# EAGLE design V0.2 (EAGLE 9.5.2)
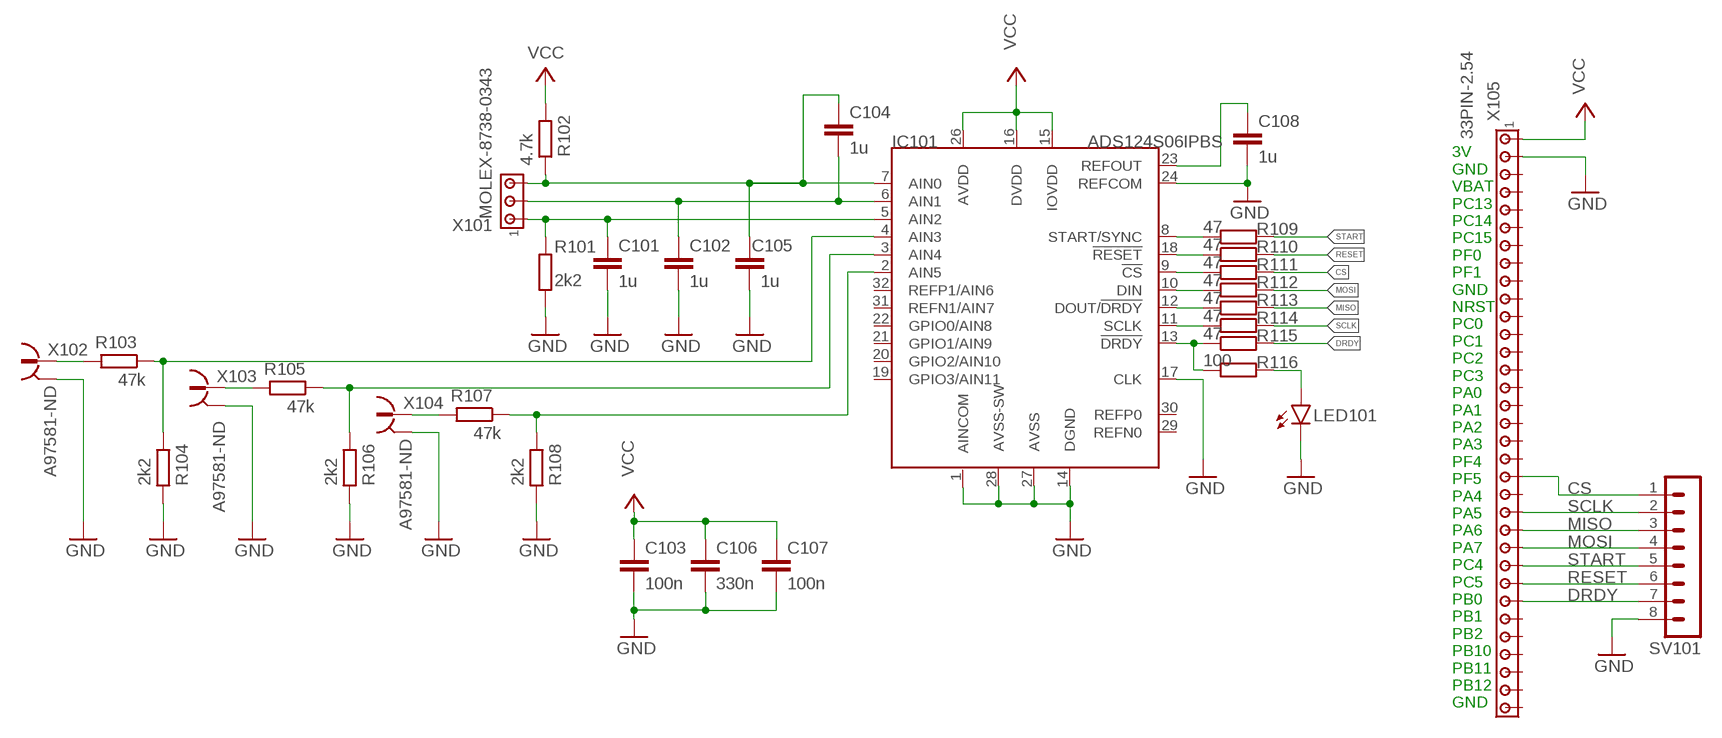
[diagram p0: schematic, sheet 1]

## Parts
C101  1u  C-EUC0603  [C0603]
C102  1u  C-EUC0603  [C0603]
C103  100n  C-EUC0603  [C0603]
C104  1u  C-EUC0603  [C0603]
C105  1u  C-EUC0603  [C0603]
C106  330n  C-EUC0603  [C0603]
C107  100n  C-EUC0603  [C0603]
C108  1u  C-EUC0603  [C0603]
IC101  ADS124S06IPBS  ADS124S0XIPBS  [TQFP32-05]
LED101  LEDSML0603  [SML0603]
R101  2k2  R-EU_R0805W  [R0805W]
R102  4.7k  R-EU_R0603  [R0603]
R103  47k  R-EU_R0603  [R0603]
R104  2k2  R-EU_R0805W  [R0805W]
R105  47k  R-EU_R0603  [R0603]
R106  2k2  R-EU_R0805W  [R0805W]
R107  47k  R-EU_R0603  [R0603]
R108  2k2  R-EU_R0805W  [R0805W]
R109  47  R-EU_R0603  [R0603]
R110  47  R-EU_R0603  [R0603]
R111  47  R-EU_R0603  [R0603]
R112  47  R-EU_R0603  [R0603]
R113  47  R-EU_R0603  [R0603]
R114  47  R-EU_R0603  [R0603]
R115  47  R-EU_R0603  [R0603]
R116  100  R-EU_R0603  [R0603]
SV101  MA08-1  [MA08-1]
X101  MOLEX-8738-0343  [MOLEX-87438-0343]
X102  A97581-ND  [1634503]
X103  A97581-ND  [1634503]
X104  A97581-ND  [1634503]
X105  33PIN-2.54  [1X33]

## Nets
AIN0: C104.1 C105.1 IC101.7(AIN0) R102.1 X101.3 X101.3_1
AIN1: C102.1 C104.2 IC101.6(AIN1) X101.2 X101.2_1
AIN2: C101.1 IC101.5(AIN2) R101.2 X101.1 X101.1_1
CS: R111.2 SV101.1 X105.20
DRDY: R115.2 SV101.7 X105.27
GND [New Class]: C101.2 C102.2 C103.2 C105.2 C106.2 C107.2 C108.2 IC101.1(AINCOM) IC101.14(DGND) IC101.17(CLK) IC101.24(REFCOM) IC101.27(AVSS) IC101.28(AVSS-SW) LED101.C R101.1 R104.1 R106.1 R108.1 SV101.8 X102.2 X102.3 X102.4 X102.5 X103.2 X103.3 X103.4 X103.5 X104.2 X104.3 X104.4 X104.5 X105.2
MISO: R113.2 SV101.3 X105.23
MOSI: R112.2 SV101.4 X105.24
N$1: IC101.8(START/SYNC) R109.1
N$2: IC101.18(!RESET) R110.1
N$3: IC101.9(!CS) R111.1
N$4: IC101.10(DIN) R112.1
N$5: IC101.12(DOUT/!DRDY) R113.1
N$6: IC101.11(SCLK) R114.1
N$7: IC101.13(!DRDY) R115.1 R116.1
N$11: IC101.4(AIN3) R103.1 R104.2
N$12: R103.2 X102.1
N$13: R105.2 X103.1
N$14: LED101.A R116.2
N$15: C108.1 IC101.23(REFOUT)
N$16: R107.2 X104.1
N$17: IC101.3(AIN4) R105.1 R106.2
N$18: IC101.2(AIN5) R107.1 R108.2
RESET: R110.2 SV101.6 X105.26
SCLK: R114.2 SV101.2 X105.22
START: R109.2 SV101.5 X105.25
VCC: C103.1 C106.1 C107.1 IC101.15(IOVDD) IC101.16(DVDD) IC101.26(AVDD) R102.2 X105.1
Unconnected: IC101.19(GPIO3/AIN11) IC101.20(GPIO2/AIN10) IC101.21(GPIO1/AIN9) IC101.22(GPIO0/AIN8) IC101.29(REFN0) IC101.30(REFP0) IC101.31(REFN1/AIN7) IC101.32(REFP1/AIN6) X105.3 X105.4 X105.5 X105.6 X105.7 X105.8 X105.9 X105.10 X105.11 X105.12 X105.13 X105.14 X105.15 X105.16 X105.17 X105.18 X105.19 X105.21 X105.28 X105.29 X105.30 X105.31 X105.32 X105.33

## Notes on the sheet
- 3V
  GND
  VBAT
  PC13
  PC14
  PC15
  PF0
  PF1
  GND
  NRST
  PC0
  PC1
  PC2
  PC3
  PA0
  PA1
  PA2
  PA3
  PF4
  PF5
  PA4
  PA5
  PA6
  PA7
  PC4
  PC5
  PB0
  PB1
  PB2
  PB10
  PB11
  PB12
  GND

## Library data of the parts
C101 C102 C104 C105 C108 = rcl:C-EU: CAPACITOR, European symbol; DIGIKEY_NR: 1276-1182-1-ND; DIGIKEY_PRICE: 0.10; SPICEPREFIX: C
C103 C107 = rcl:C-EU: CAPACITOR, European symbol; DIGIKEY_NR: 1276-6439-1-ND; DIGIKEY_PRICE: 0.10; SPICEPREFIX: C
C106 = rcl:C-EU: CAPACITOR, European symbol; DIGIKEY_NR: 490-6050-1-ND; DIGIKEY_PRICE: 0.22; SPICEPREFIX: C
IC101 = ADC-Erweiterung:ADS124S0X; DIGIKEY_NR: 296-45188-ND; DIGIKEY_PRICE: 10.15
LED101 = led:LED: LED OSRAM: - CHIPLED LG R971, LG N971, LY N971, LG Q971, LY Q971, LO R971, LY R971 LH N974, LH R974 LS Q976, LO Q976, LY Q976 LO Q996 - Hyper CHIPLED LW Q18S LB Q993, LB Q99A, LB R99A - SideLED LS A670, LO A670, LY A670, LG A670, LP A670 LB A673, LV A673, LT A673, LW A673 LH A674 LY A675 LS A676, LA A676, LO A676, LY A676, LW A676 LS A679, LY A679, LG A679 - Hyper Micro SIDELED® LS Y876, LA Y876, LO Y876, LY Y876 LT Y87S - SmartLED LW L88C, LW L88S LB L89C, LB L89S, LG L890 LS L89K, LO L89K, LY L89K LS L896, LA L896, LO L896, LY L896 - TOPLED LS T670, LO T670, LY T670, LG T670, LP T670 LSG T670, LSP T670, LSY T670, LOP T670, LYG T670 LG T671, LOG T671, LSG T671 LB T673, LV T673, LT T673, LW T673 LH T674 LS T676, LA T676, LO T676, LY T676, LB T676, LH T676, LSB T676, LW T676 LB T67C, LV T67C, LT T67C, LS T67K, LO T67K, LY T67K, LW E67C LS E67B, LA E67B, LO E67B, LY E67B, LB E67C, LV E67C, LT E67C LW T67C LS T679, LY T679, LG T679 LS T770, LO T770, LY T770, LG T770, LP T770 LB T773, LV T773, LT T773, LW T773 LH T774 LS E675, LA E675, LY E675, LS T675 LS T776, LA T776, LO T776, LY T776, LB T776 LHGB T686 LT T68C, LB T68C - Hyper Mini TOPLED® LB M676 - Mini TOPLED Santana® LG M470 LS M47K, LO M47K, LY M47K Source: http://www.osram.convergy.de LUXEON: - LUMILED® LXK2-PW12-R00, LXK2-PW12-S00, LXK2-PW14-U00, LXK2-PW14-V00 LXK2-PM12-R00, LXK2-PM12-S00, LXK2-PM14-U00 LXK2-PE12-Q00, LXK2-PE12-R00, LXK2-PE12-S00, LXK2-PE14-T00, LXK2-PE14-U00 LXK2-PB12-K00, LXK2-PB12-L00, LXK2-PB12-M00, LXK2-PB14-N00, LXK2-PB14-P00, LXK2-PB14-Q00 LXK2-PR12-L00, LXK2-PR12-M00, LXK2-PR14-Q00, LXK2-PR14-R00 LXK2-PD12-Q00, LXK2-PD12-R00, LXK2-PD12-S00 LXK2-PH12-R00, LXK2-PH12-S00 LXK2-PL12-P00, LXK2-PL12-Q00, LXK2-PL12-R00 Source: www.luxeon.com KINGBRIGHT: KA-3528ASYC Source: www.kingbright.com; DIGIKEY_NR: 475-3118-1-ND; DIGIKEY_PRICE: 0.52
R101 R104 R106 R108 = rcl:R-EU_: RESISTOR, European symbol; DIGIKEY_NR: 408-1635-1-ND; DIGIKEY_PRICE: 4.37; SPICEPREFIX: R
R102 = rcl:R-EU_: RESISTOR, European symbol; DIGIKEY_NR: 311-4.70KHRCT-ND; DIGIKEY_PRICE: 0.10; SPICEPREFIX: R
R103 R105 R107 = rcl:R-EU_: RESISTOR, European symbol; DIGIKEY_NR: P123333CT-ND; DIGIKEY_PRICE: 0.10; SPICEPREFIX: R
R109-R115 = rcl:R-EU_: RESISTOR, European symbol; DIGIKEY_NR: 311-470GRCT-ND; DIGIKEY_PRICE: 0.10; SPICEPREFIX: R
R116 = rcl:R-EU_: RESISTOR, European symbol; DIGIKEY_NR: 311-100DCT-ND; DIGIKEY_PRICE: 0.20; SPICEPREFIX: R
SV101 = con-lstb:MA08-1: PIN HEADER; DIGIKEY_NR: 732-5321-ND; DIGIKEY_PRICE: 0.37; OC_FARNELL: unknown; OC_NEWARK: unknown
X101 = ADC-Erweiterung:MOLEX-8738-0343; DIGIKEY_NR: WM7647CT-ND; DIGIKEY_PRICE: 0.81
X102-X104 = ADC-Erweiterung:A97581-ND; DIGIKEY_NR: A97581-ND; DIGIKEY_PRICE: 1.73
X105 = ADC-Erweiterung:33PIN-2.54; DIGIKEY_NR: 609-2223-ND; DIGIKEY_PRICE: 1.41

## Board
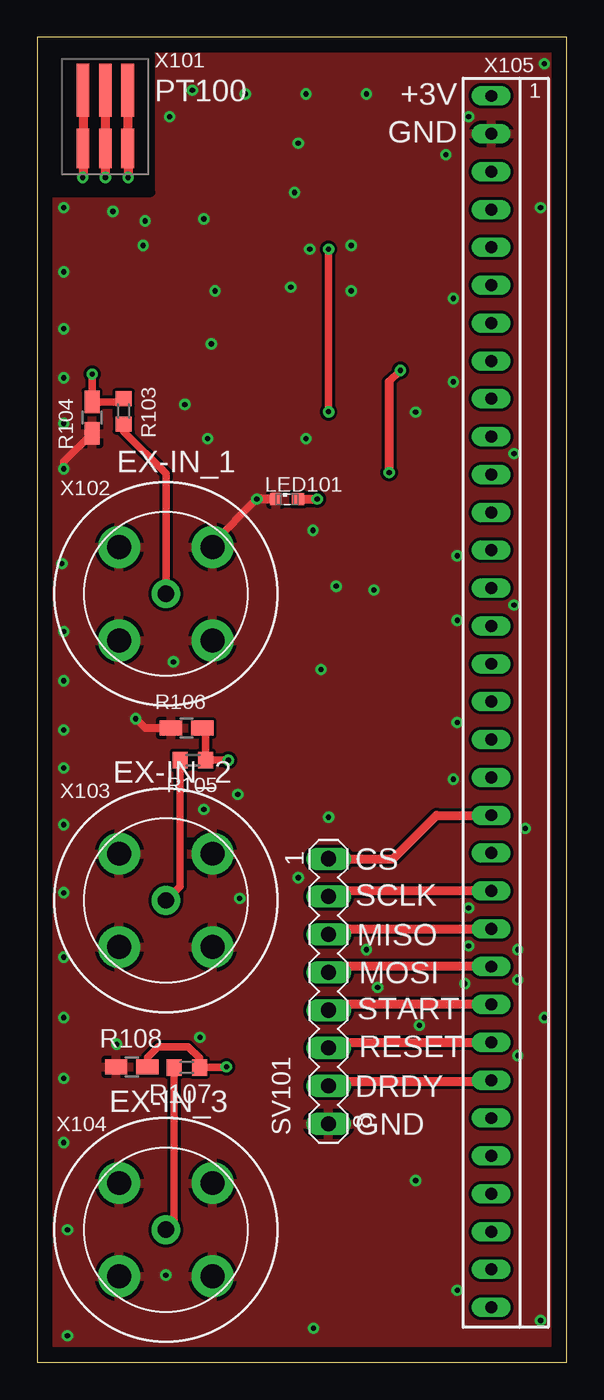
[diagram p1: board, top side]
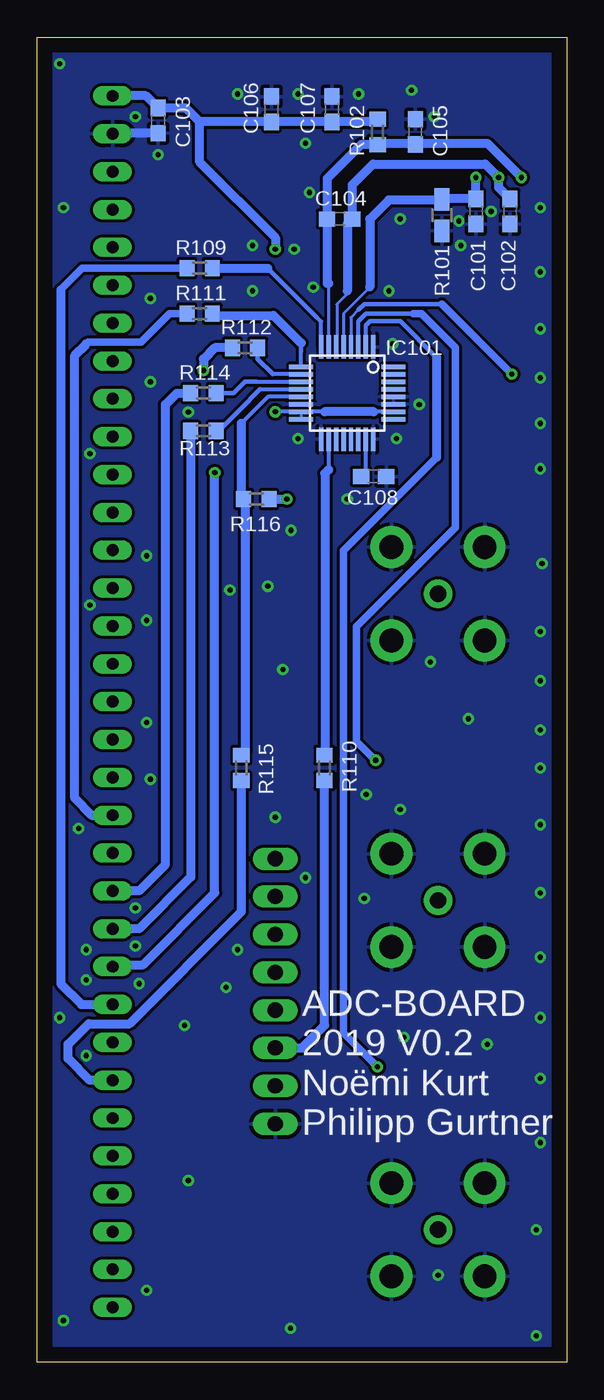
[diagram p2: board, bottom side, seen from below]

Size 35.54 x 88.9 mm. Coordinates in mm from the lower left corner, seen from the top.
Outline: 0,0 35.54,0 35.54,88.9 0,88.9 0,0
Copper layers (1*16): Top 0.035mm / dielectric 1.5mm / Bottom 0.035mm
Design rules "default *": minimum track width 6mil, minimum drill 0.35mm, track to track 0.2mm, track to pad 0.2mm, pad to pad 0.2mm, via to via 0.2mm, smd to smd 6mil, copper to edge 40mil, drill to drill 6mil, minimum pad ring 10mil, minimum via ring 8mil, stop-mask expansion 4mil, vias tented up to drill 0mil, thermal gap 10mil
tRestrict: area 0.3,78.5 to 7.6,88.1

### Footprints (pad centres in the part's own frame; a part is rotated, then mirrored left to right if it is on the bottom)
C0603 = smd 1.1 x 1: 1 -0.85,0; 2 0.85,0
TQFP32-05 = smd 1.6 x 0.3: 1 -3.1,1.75; 2 -3.1,1.25; 3 -3.1,0.75; 4 -3.1,0.25; 5 -3.1,-0.25; 6 -3.1,-0.75; 7 -3.1,-1.25; 8 -3.1,-1.75; 17 3.1,-1.75; 18 3.1,-1.25; 19 3.1,-0.75; 20 3.1,-0.25; 21 3.1,0.25; 22 3.1,0.75; 23 3.1,1.25; 24 3.1,1.75 | smd 0.3 x 1.6: 9 -1.75,-3.1; 10 -1.25,-3.1; 11 -0.75,-3.1; 12 -0.25,-3.1; 13 0.25,-3.1; 14 0.75,-3.1; 15 1.25,-3.1; 16 1.75,-3.1; 25 1.75,3.1; 26 1.25,3.1; 27 0.75,3.1; 28 0.25,3.1; 29 -0.25,3.1; 30 -0.75,3.1; 31 -1.25,3.1; 32 -1.75,3.1
SML0603 = smd 0.8 x 0.8: A 0.75,0; C -0.75,0
R0805W = smd 1.5 x 1: 1 -1.052,0; 2 1.052,0
R0603 = smd 1 x 1.1: 1 -0.85,0; 2 0.85,0
MA08-1 = drill 1.016 long: 1 -8.89,0; 2 -6.35,0; 3 -3.81,0; 4 -1.27,0; 5 1.27,0; 6 3.81,0; 7 6.35,0; 8 8.89,0
MOLEX-87438-0343 = smd 3.55 x 0.85: 1 -1.775,1.5; 2 -1.775,0; 3 -1.775,-1.5 | smd 2.65 x 0.85: 1_1 2.125,1.5; 2_1 2.125,0; 3_1 2.125,-1.5
1634503 = drill 1.1 pad 1.93: 1 0,0 | drill 1.6 pad 2.8: 2 3.13,3.13; 3 3.13,-3.13; 4 -3.13,-3.13; 5 -3.13,3.13
1X33 = drill 0.8 long: 1 -39.497,0; 2 -36.957,0; 3 -34.417,0; 4 -31.877,0; 5 -29.337,0; 6 -26.797,0; 7 -24.257,0; 8 -21.717,0; 9 -19.177,0; 10 -16.637,0; 11 -14.097,0; 12 -11.557,0; 13 -9.017,0; 14 -6.477,0; 15 -3.937,0; 16 -1.397,0; 17 1.143,0; 18 3.683,0; 19 6.223,0; 20 8.763,0; 21 11.303,0; 22 13.843,0; 23 16.383,0; 24 18.923,0; 25 21.463,0; 26 24.003,0; 27 26.543,0; 28 29.083,0; 29 31.623,0; 30 34.163,0; 31 36.703,0; 32 39.243,0; 33 41.783,0

### Placement (x,y rotation side)
C101  6.1,77.22 270 bottom
C102  3.81,77.22 270 bottom
C103  27.43,83.31 270 bottom
C104  15.24,76.71 0 bottom
C105  10.16,82.55 90 bottom
C106  19.81,84.07 90 bottom
C107  15.75,84.07 90 bottom
C108  12.95,59.44 0 bottom
IC101  14.73,65.02 270 bottom
LED101  16.76,57.91 0 top
R101  8.38,76.96 90 bottom
R102  12.7,82.55 90 bottom
R103  5.8,63.81 270 top
R104  3.68,63.37 90 top
R105  10.45,40.4 180 top
R106  10.03,42.55 0 top
R107  10.04,19.78 180 top
R108  6.35,19.81 0 top
R109  24.64,73.41 180 bottom
R110  16.26,39.88 270 bottom
R111  24.64,70.36 180 bottom
R112  21.59,68.07 180 bottom
R113  24.38,62.48 180 bottom
R114  24.38,65.02 180 bottom
R115  21.84,39.88 270 bottom
R116  20.83,57.91 0 bottom
SV101  19.56,24.89 270 top
X101  4.57,83.57 270 top
X102  8.64,51.56 0 top
X103  8.64,30.99 0 top
X104  8.64,8.89 0 top
X105  30.48,45.47 270 top

### Tracks (layer width: path | path; a pad name or v marks a point on that pad's centre or on a via)
AIN0  (via drill 0.35)
  Top 0.61: X101.3 X101.3_1 3.07,79.53 v3.05,79.5
  Bottom 0.203: 15.98,72.39 IC101.7
  Bottom 0.61: 15.98,72.39 16.09,72.39 C104.1 16.09,79.41 13.8,81.7 R102.1 12.61,81.79 10.25,81.79 C105.1 10.07,81.79 5.33,81.79 v3.05,79.5
AIN1  (via drill 0.35)
  Top 0.61: X101.2 X101.2_1 v4.57,79.5
  Bottom 0.203: 14.73,71.88 14.73,71.69 15.43,70.99 15.43,68.2 15.49,68.14
  Bottom 0.254: 15.49,68.14 IC101.6
  Bottom 0.61: 14.73,71.88 14.73,76.37 C104.2 14.39,78.99 13,80.39 5.48,80.39 4.59,79.5 v4.57,79.5 4.57,78.83 C102.1
AIN2  (via drill 0.35)
  Top 0.61: X101.1 X101.1_1 6.1,81.42 v6.1,79.5
  Bottom 0.203: 13.21,72.14 14.98,70.36 IC101.5
  Bottom 0.61: v6.1,79.5 C101.1 8.33,78.07 R101.2 8.42,77.98 11.94,77.98 13.21,76.71 13.21,72.14
CS
  Top 0.61: X105.20 26.8,36.7 23.88,33.78 SV101.1
  Bottom 0.508: 32.26,68.33 32.13,68.45 28.57,68.45 26.67,70.36 R111.2
  Bottom 0.61: 32.26,68.33 33.02,67.56 33.02,37.85 31.88,36.7 X105.20
DRDY
  Top 0.61: SV101.7 19.81,18.8 30.35,18.8 X105.27
  Bottom 0.61: X105.27 32,18.92 33.47,20.38 33.47,21.34 32.08,22.72 29.35,22.72 21.84,30.23 R115.2
GND  (via drill 0.35)
  Top 0.508: R106.1 7.24,42.55 v6.6,43.18 | v14.73,57.91 11.77,54.95 X102.2 | R104.1 1.78,60.42 v1.78,59.94
  Top 0.61: LED101.C v14.73,57.91
  Bottom 0.61: C103.2 30.44,82.46 X105.2
  other vias: 28.96,83.57 7.11,74.93 8.64,5.84 28.19,4.83 18.03,61.98 11.43,61.98 27.94,65.79 27.94,71.37 1.78,77.47 9.14,46.99 11.18,37.08 19.56,36.58 1.78,73.15 1.78,69.34 1.78,66.04 1.78,62.99 1.65,53.59 19.05,46.48 1.78,49.02 1.78,45.72 1.78,42.42 1.78,39.88 1.78,36.07 13.46,38.1 1.78,31.5 1.78,27.18 1.78,23.11 1.78,19.05 1.78,14.73 5.33,21.34 10.92,21.8 2.03,8.89 2.03,1.78 18.54,2.29 33.78,2.79 34.04,23.11 25.65,22.61 22.86,25.15 22.1,27.69 13.59,31.11 17.53,32.51 28.19,42.93 27.94,39.12 28.19,49.78 28.19,54.1 18.51,55.82 20.07,52.07 11.68,68.33 18.29,74.68 21.08,74.93 21.08,71.88 17.02,72.14 18.03,85.09 13.97,85.09 17.53,81.79 22.1,85.09 27.43,81.03 34.04,87.12 33.78,77.47 10.41,85.34 8.89,83.57 9.91,64.26 22.61,51.82 32.77,35.81 32.26,27.69 28.7,25.4 28.96,27.94 28.96,30.48 32.26,25.65 25.4,63.75 11.18,76.71 11.94,71.88 17.27,78.49 5.08,77.22 7.24,76.58 32,60.96 32,50.8 32.26,20.57 25.4,12.19
  pour Bottom: -6.35,1.52 -0.51,-4.32 35.05,-4.32 37.85,-1.52 37.85,92.71 36.83,93.73 -1.27,93.73 -5.84,89.15 -6.35,89.15
  pour Top: 0,88.9 0,0.25 0.25,0 35.56,0 35.81,0.25 35.81,88.9
MISO
  Top 0.61: SV101.3 19.94,29.08 X105.23
  Bottom 0.61: R113.2 25.23,32.55 28.7,29.08 X105.23
MOSI  (via drill 0.35)
  Top 0.508: v24.38,66.55 23.62,65.79
  Top 0.61: X105.24 19.94,26.54 SV101.4 | 23.62,65.79 v23.62,59.69
  Bottom 0.61: R112.2 23.62,68.07 24.38,67.31 v24.38,66.55 | X105.24 30.35,26.67 28.45,26.67 23.62,31.5 v23.62,59.69
N$1
  Bottom 0.254: IC101.8 16.48,69.82 16.76,70.1
  Bottom 0.305: 16.76,70.1 20.07,73.41
  Bottom 0.61: R109.1 20.07,73.41
N$2
  Bottom 0.254: IC101.18 15.98,59.89
  Bottom 0.61: R110.1 16.24,40.75 16.24,59.64 15.98,59.89
N$3
  Bottom 0.254: IC101.9 17.83,67.82
  Bottom 0.305: 17.83,67.82 17.83,68.38
  Bottom 0.61: R111.1 23.66,70.23 19.68,70.23 17.83,68.38
N$4
  Bottom 0.254: IC101.10 17.85,66.29 19.72,66.29
  Bottom 0.305: 19.72,66.29 20.74,67.31 R112.1
N$5
  Bottom 0.254: IC101.12 20.57,65.27 20.57,65.28
  Bottom 0.305: 20.57,65.28 21.97,63.88 23.37,62.48 R113.1
N$6
  Bottom 0.254: IC101.11 20.82,65.77 20.83,65.79
  Bottom 0.305: 20.83,65.79 21.59,65.79 22.35,65.02 R114.1
N$7
  Bottom 0.254: 21.84,62.99 20.06,64.77 IC101.13
  Bottom 0.61: 21.84,62.99 21.84,58.08 R116.1 21.59,57.82 21.59,40.98 R115.1
N$11  (via drill 0.35)
  Top 0.508: R103.1 5.57,64.42 R104.2 v3.68,66.29
  Bottom 0.203: 13.97,70.61 14.48,70.1 IC101.4
  Bottom 0.305: 8.38,70.99 13.59,70.99 13.97,70.61
  Bottom 0.508: 8.38,70.99 v3.68,66.29
N$12
  Top 0.508: R103.2 5.8,62.45 8.64,59.62 X102.1
N$13
  Top 0.508: R105.2 9.6,31.91 8.68,30.99 X103.1
N$14  (via drill 0.35)
  Top 0.61: LED101.A v18.8,57.91
  Bottom 0.61: R116.2 v18.8,57.91
N$15
  Bottom 0.254: C108.1 13.48,59.76 IC101.23
N$16
  Top 0.508: R107.2 9.19,9.44 X104.1
N$17  (via drill 0.35)
  Top 0.508: v12.83,40.39 12.82,40.4 R105.1 11.3,42.33 R106.2
  Bottom 0.254: IC101.3 13.97,68.14 13.97,69.85
  Bottom 0.305: 13.97,69.85 13.46,70.36 10.29,70.36
  Bottom 0.508: v12.83,40.39 14.1,41.66 14.1,49.36 7.47,55.99 7.47,68.07 9.75,70.36 10.29,70.36
N$18  (via drill 0.35)
  Top 0.508: v12.7,19.81 12.67,19.78 R107.1 10.89,20.41 10.13,21.17 8.12,21.17 7.4,20.45 R108.2
  Bottom 0.254: IC101.2 13.48,69.58
  Bottom 0.305: 13.48,69.58 13.21,69.85 11.18,69.85 8.74,67.41
  Bottom 0.508: v12.7,19.81 14.99,22.1 14.99,54.46 8.74,60.71
  Bottom 0.61: 8.74,67.41 8.74,60.71
RESET
  Top 0.61: SV101.6 19.94,21.46 X105.26
  Bottom 0.61: R110.2 16.26,22.61 17.78,21.08 SV101.6
SCLK
  Top 0.61: X105.22 19.94,31.62 SV101.2
  Bottom 0.61: R114.2 26.16,65.02 26.92,64.26 26.92,33.4 28.7,31.62 X105.22
START
  Top 0.61: X105.25 19.94,24 SV101.5
  Bottom 0.508: R109.2 32.51,73.41 33.97,71.95
  Bottom 0.61: 33.97,71.95 33.97,25.4 32.57,24 X105.25
VCC  (via drill 0.35)
  Top 0.508: v19.56,74.68 v19.56,63.77
  Bottom 0.2: IC101.15 IC101.16
  Bottom 0.254: IC101.15 v19.56,63.77 16.26,63.77 | IC101.26 12.95,63.77
  Bottom 0.61: R102.2 12.7,83.22 C107.1 C106.1 24.64,83.22 | X105.1 28.23,84.96 C103.1 25.58,84.16 24.64,83.22 | 24.64,83.22 24.64,80.52 19.56,75.44 v19.56,74.68 | 12.95,63.77 16.26,63.77

### Text on the board
tNames: +3V | PT100 | 1 | GND | EX-IN_1 | EX-IN_2 | CS | SCLK | MISO | MOSI | START | RESET | DRDY | EX-IN_3 | GND
bNames: ADC-BOARD / 2019 V0.2 / Noëmi Kurt / Philipp Gurtner
tDocu: 1